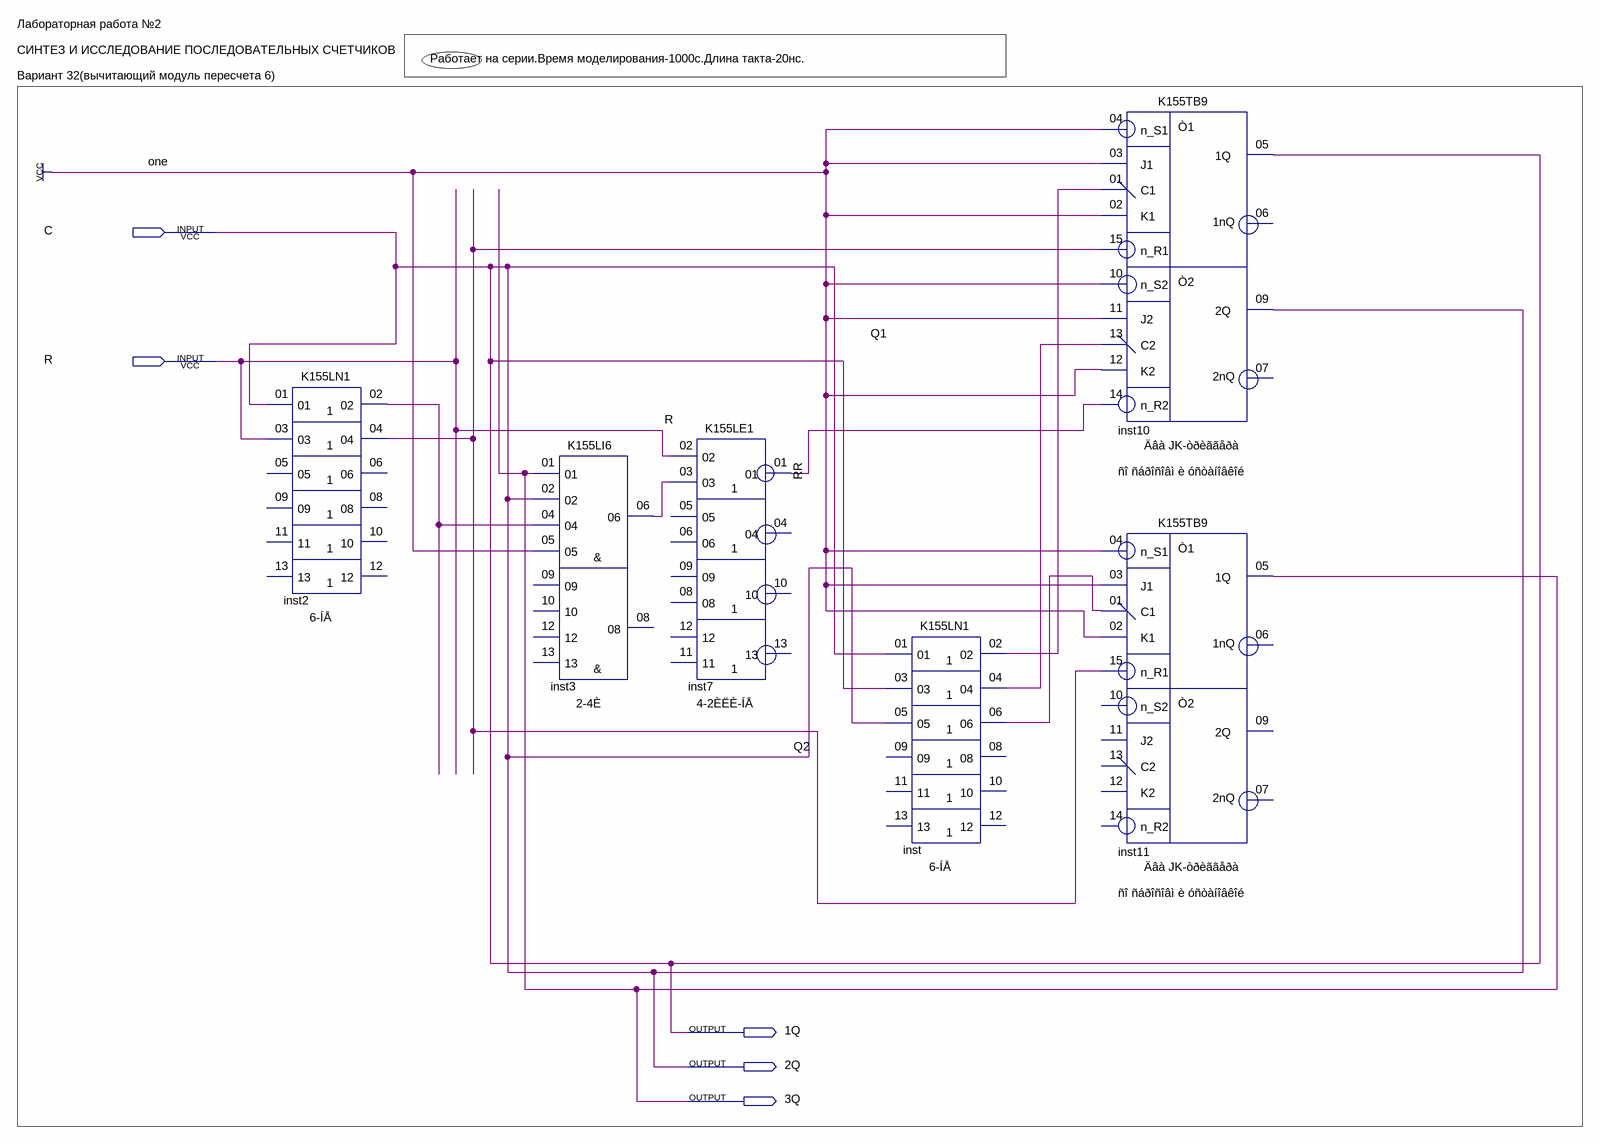
[diagram p0: schematic sheet]
// Quartus schematic 2_lab.bdf as structural Verilog: 6 symbols, 5 pins
module \2_lab  (
  input  C,
  input  R,
  output \1Q ,
  output \2Q ,
  output \3Q 
);

  wire inst2_02, inst2_04, inst3_06, inst_02, inst_06, Q1, RR;

  K155LN1 inst2 (.\01 (C), .\03 (R), .\02 (inst2_02), .\04 (inst2_04));  // open: 05, 09, 11, 13, 06, 08, 10, 12
  K155LI6 inst3 (.\01 (\3Q ), .\02 (C), .\04 (inst2_02), .\05 (1'b1), .\06 (inst3_06));  // open: 09, 10, 12, 13, 08
  K155LE1 inst7 (.\02 (R), .\03 (inst3_06), .\01 (RR));  // open: 05, 06, 09, 08, 12, 11, 04, 10, 13
  K155LN1 inst (
    .\01 (C), .\03 (C), .\05 (C), .\02 (inst_02), .\04 (Q1), .\06 (inst_06));  // open: 09, 11, 13, 08, 10, 12
  K155TB9 inst10 (
    .n_S1(1'b1), .J1(1'b1), .n_R1(inst2_04), .C1(inst_02), .K1(1'b1), .n_S2(1'b1), .J2(1'b1), .n_R2(RR),
    .C2(Q1), .K2(1'b1), .\1Q (C), .\2Q (C));  // open: 1nQ, 2nQ
  K155TB9 inst11 (
    .n_S1(1'b1), .J1(1'b1), .n_R1(inst2_04), .C1(inst_06), .K1(1'b1), .\1Q (\3Q ));  // open: n_S2, J2, n_R2, C2, K2, 1nQ, 2Q, 2nQ

  assign \1Q  = C;
  assign \2Q  = C;

  // Other names for the same wires on the sheet: Q2 = C

  // Notes on the sheet:
  //   Лабораторная работа №2
  //   СИНТЕЗ И ИССЛЕДОВАНИЕ ПОСЛЕДОВАТЕЛЬНЫХ СЧЕТЧИКОВ
  //   Работает на серии.Время моделирования-1000с.Длина такта-20нс.
  //   Вариант 32(вычитающий модуль пересчета 6)
endmodule
